# EAGLE design noise (EAGLE 7.4.0)
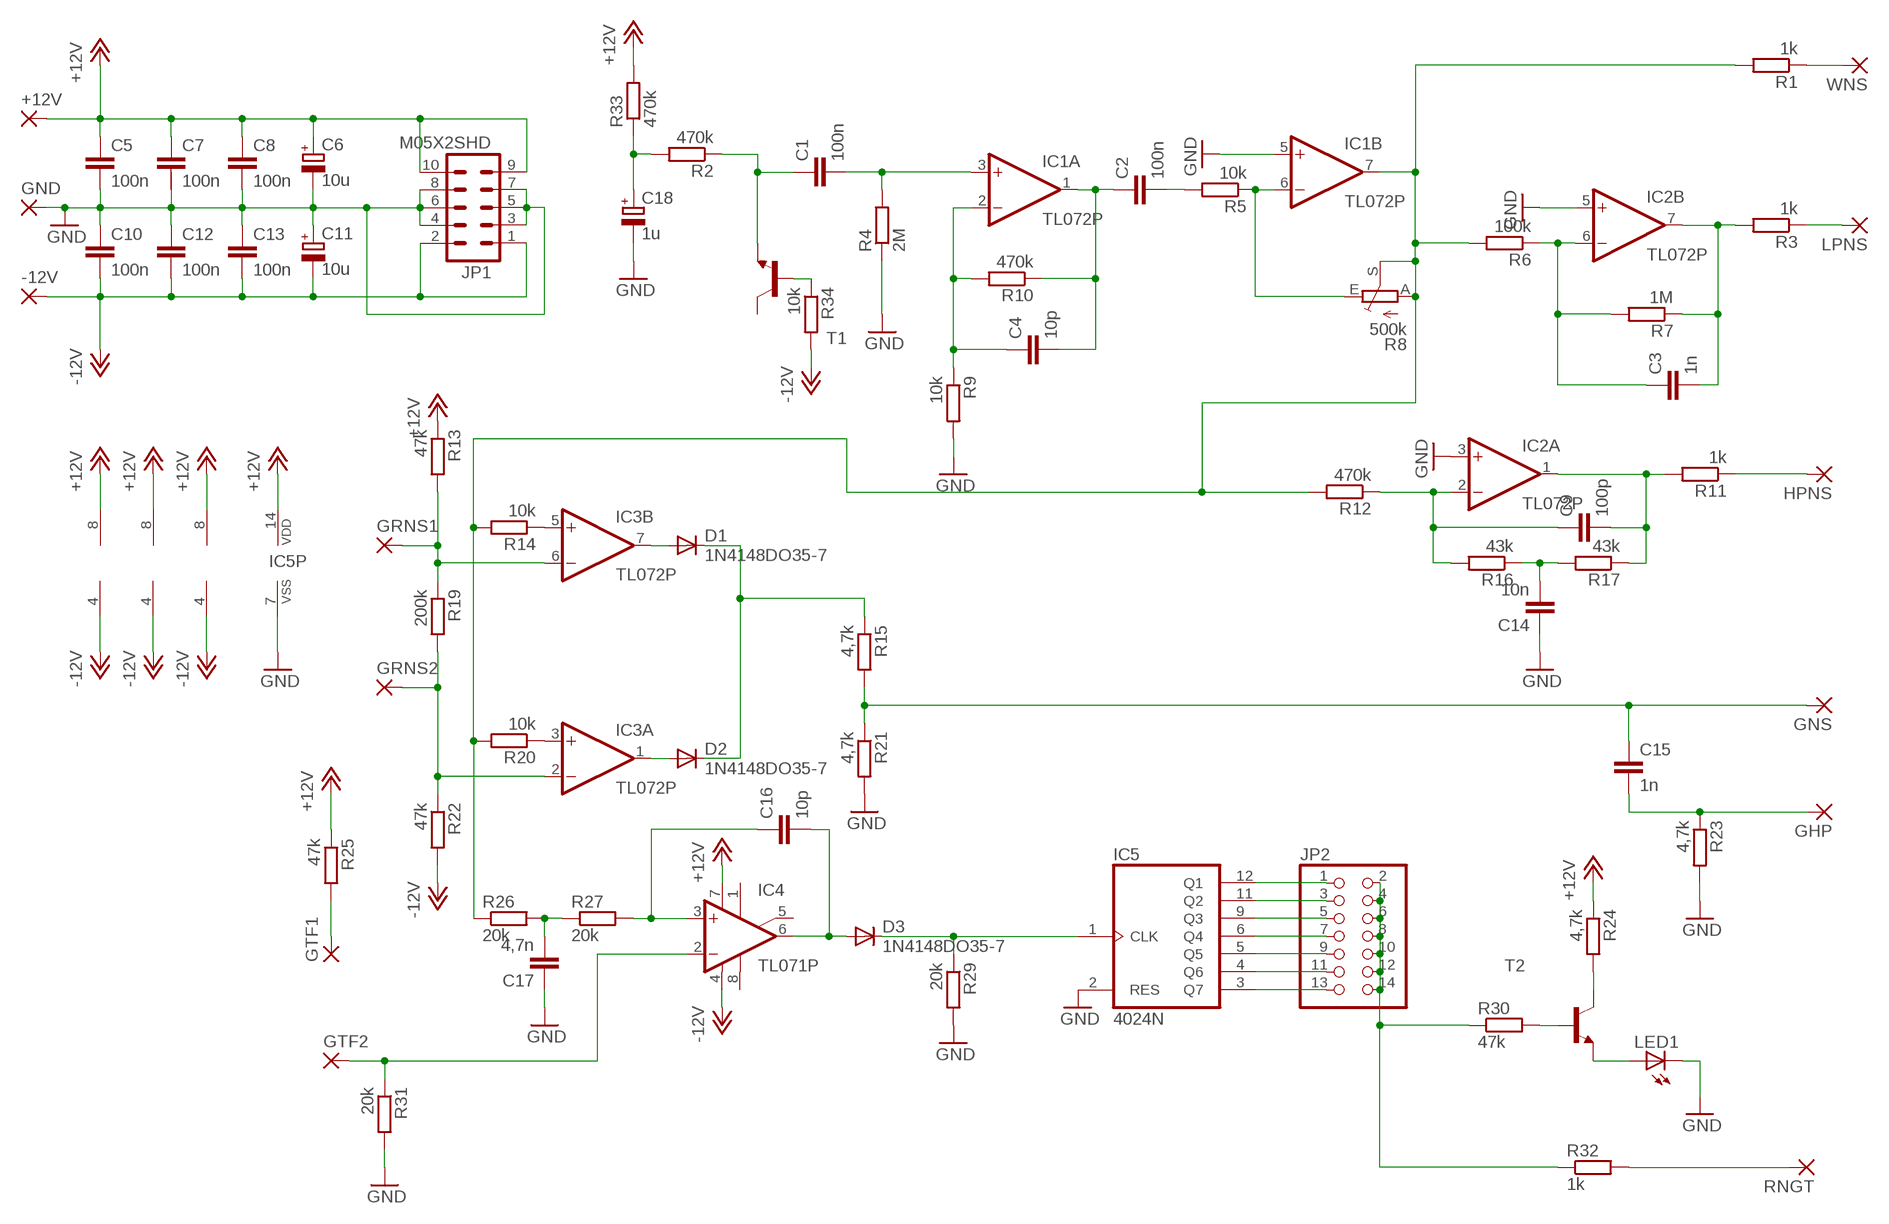
[diagram p0: schematic, sheet 1]

## Parts
+12V  2,54/1,0  [2,54/1,0]
-12V  2,54/1,0  [2,54/1,0]
C1  100n  C-EU050-035X075  [C050-035X075]
C2  100n  C-EU050-035X075  [C050-035X075]
C3  1n  C-EU050-035X075  [C050-035X075]
C4  10p  C-EU050-035X075  [C050-035X075]
C5  100n  C-EU050-035X075  [C050-035X075]
C6  10u  CPOL-EUE2.5-6  [E2,5-6]
C7  100n  C-EU050-035X075  [C050-035X075]
C8  100n  C-EU050-035X075  [C050-035X075]
C9  100p  C-EU050-035X075  [C050-035X075]
C10  100n  C-EU050-035X075  [C050-035X075]
C11  10u  CPOL-EUE2.5-6  [E2,5-6]
C12  100n  C-EU050-035X075  [C050-035X075]
C13  100n  C-EU050-035X075  [C050-035X075]
C14  10n  C-EU050-035X075  [C050-035X075]
C15  1n  C-EU050-035X075  [C050-035X075]
C16  10p  C-EU050-035X075  [C050-035X075]
C17  4,7n  C-EU050-035X075  [C050-035X075]
C18  1u  CPOL-EUE2-5  [E2-5]
D1  1N4148DO35-7  [DO35-7]
D2  1N4148DO35-7  [DO35-7]
D3  1N4148DO35-7  [DO35-7]
GHP  2,54/1,0  [2,54/1,0]
GND  2,54/1,0  [2,54/1,0]
GNS  2,54/1,0  [2,54/1,0]
GRNS1  2,54/1,0  [2,54/1,0]
GRNS2  2,54/1,0  [2,54/1,0]
GTF1  2,54/1,0  [2,54/1,0]
GTF2  2,54/1,0  [2,54/1,0]
HPNS  2,54/1,0  [2,54/1,0]
IC1  TL072P  [DIL08]
IC2  TL072P  [DIL08]
IC3  TL072P  [DIL08]
IC4  TL071P  [DIL08]
IC5  4024N  [DIL14]
JP1  M05X2SHD  [2X5-SHROUDED]
JP2  PINHD-2X7  [2X07]
LED1  LED3MM  [LED3MM]
LPNS  2,54/1,0  [2,54/1,0]
R1  1k  R-EU_0309/10  [0309/10]
R2  470k  R-EU_0309/10  [0309/10]
R3  1k  R-EU_0309/10  [0309/10]
R4  2M  R-EU_0309/10  [0309/10]
R5  10k  R-EU_0309/10  [0309/10]
R6  100k  R-EU_0309/10  [0309/10]
R7  1M  R-EU_0309/10  [0309/10]
R8  500k  TRIM_EU-RJ9W  [RJ9W]
R9  10k  R-EU_0309/10  [0309/10]
R10  470k  R-EU_0309/10  [0309/10]
R11  1k  R-EU_0309/10  [0309/10]
R12  470k  R-EU_0309/10  [0309/10]
R13  47k  R-EU_0309/10  [0309/10]
R14  10k  R-EU_0309/10  [0309/10]
R15  4,7k  R-EU_0309/10  [0309/10]
R16  43k  R-EU_0309/10  [0309/10]
R17  43k  R-EU_0309/10  [0309/10]
R19  200k  R-EU_0309/10  [0309/10]
R20  10k  R-EU_0309/10  [0309/10]
R21  4,7k  R-EU_0309/10  [0309/10]
R22  47k  R-EU_0309/10  [0309/10]
R23  4,7k  R-EU_0309/10  [0309/10]
R24  4,7k  R-EU_0309/10  [0309/10]
R25  47k  R-EU_0309/10  [0309/10]
R26  20k  R-EU_0309/10  [0309/10]
R27  20k  R-EU_0309/10  [0309/10]
R29  20k  R-EU_0309/10  [0309/10]
R30  47k  R-EU_0309/10  [0309/10]
R31  20k  R-EU_0309/10  [0309/10]
R32  1k  R-EU_0309/10  [0309/10]
R33  470k  R-EU_0309/10  [0309/10]
R34  10k  R-EU_0309/10  [0309/10]
RNGT  2,54/1,0  [2,54/1,0]
T1  2N3904-NPN-TO92-EBC  [TO92-EBC]
T2  2N3904-NPN-TO92-EBC  [TO92-EBC]
WNS  2,54/1,0  [2,54/1,0]

## Nets
+12V: +12V.1(P) C5.1 C6.+ C7.1 C8.1 IC1.8(P:V+) IC2.8(P:V+) IC3.8(P:V+) IC4.7(V+) IC5.14(VDD) JP1.9 JP1.10 R13.1 R24.1 R25.1 R33.2
-12V: -12V.1(P) C10.2 C11.- C12.2 C13.2 IC1.4(P:V-) IC2.4(P:V-) IC3.4(P:V-) IC4.4(V-) JP1.1 JP1.2 R22.2 R34.2
GND: C5.2 C6.- C7.2 C8.2 C10.1 C11.+ C12.1 C13.1 C14.1 C17.1 C18.- GND.1(P) IC1.5(B:+IN) IC2.3(A:+IN) IC2.5(B:+IN) IC5.2(RES) IC5.7(VSS) JP1.3 JP1.4 JP1.5 JP1.6 JP1.7 JP1.8 LED1.K(C) R4.1 R9.2 R21.2 R23.2 R29.2 R31.2
N$1: C18.+ R2.2 R33.1
N$2: C1.1 R2.1 T1.E
N$3: R34.1 T1.B
N$4: C1.2 IC1.3(A:+IN) R4.2
N$5: C4.1 IC1.2(A:-IN) R9.1 R10.2
N$6: C15.2 GHP.1(P) R23.1
N$7: C2.2 R5.2
N$8: IC1.6(B:-IN) R5.1 R8.E
N$9: IC1.7(B:OUT) R1.2 R6.2 R8.A R8.S R12.2 R14.2 R20.2 R26.1
N$10: R1.1 WNS.1(P)
N$11: C3.1 IC2.6(B:-IN) R6.1 R7.2
N$12: C3.2 IC2.7(B:OUT) R3.2 R7.1
N$13: LPNS.1(P) R3.1
N$14: C9.1 IC2.2(A:-IN) R12.1 R16.2
N$15: C14.2 R16.1 R17.2
N$16: C9.2 IC2.1(A:OUT) R11.2 R17.1
N$17: HPNS.1(P) R11.1
N$18: IC3.5(B:+IN) R14.1
N$19: IC3.3(A:+IN) R20.1
N$20: GRNS1.1(P) IC3.6(B:-IN) R13.2 R19.1
N$21: GRNS2.1(P) IC3.2(A:-IN) R19.2 R22.1
N$23: D1.A IC3.7(B:OUT)
N$24: D2.A IC3.1(A:OUT)
N$25: D1.C D2.C R15.1
N$26: C15.1 GNS.1(P) R15.2 R21.1
N$27: GTF2.1(P) IC4.2(-IN) R31.1
N$28: GTF1.1(P) R25.2
N$29: C16.2 D3.A IC4.6(OUT)
N$30: C16.1 IC4.3(+IN) R27.2
N$31: C17.2 R26.2 R27.1
N$32: D3.C IC5.1(CLK) R29.1
N$33: IC5.12(Q1) JP2.1
N$34: IC5.11(Q2) JP2.3
N$35: IC5.9(Q3) JP2.5
N$36: IC5.6(Q4) JP2.7
N$37: IC5.5(Q5) JP2.9
N$38: IC5.4(Q6) JP2.11
N$39: IC5.3(Q7) JP2.13
N$40: JP2.2 JP2.4 JP2.6 JP2.8 JP2.10 JP2.12 JP2.14 R30.1 R32.1
N$41: R30.2 T2.B
N$42: R24.2 T2.C
N$43: LED1.A T2.E
N$44: R32.2 RNGT.1(P)
N$45: C2.1 C4.2 IC1.1(A:OUT) R10.1
Unconnected: IC4.1(ON1) IC4.5(ON2) IC4.8(OPT) T1.C

## Library data of the parts
+12V -12V GHP GND GNS GRNS1 GRNS2 GTF1 GTF2 HPNS LPNS RNGT WNS = wirepad:2,54/1,0: THROUGH-HOLE PAD
C1-C5 C7-C10 C12-C17 = rcl:C-EU: CAPACITOR, European symbol
C6 C11 C18 = rcl:CPOL-EU: POLARIZED CAPACITOR, European symbol
D1-D3 = diode:1N4148: DIODE high speed (Philips)
IC1-IC3 = cavalier:TL072: OP AMP
IC4 = cavalier:TL071: OP AMP
IC5 = 40xx:4024: 7-stage binary/ripple COUNTER
JP1 = SparkFun:M05X2: Header 5x2 Standard 10-pin dual row 0.1" header. Commonly used with AVR-ISP. Use with Spark Fun Electronics SKU: PRT-00778
JP2 = pinhead:PINHD-2X7: PIN HEADER
LED1 = led:LED: LED OSRAM: - CHIPLED LG R971, LG N971, LY N971, LG Q971, LY Q971, LO R971, LY R971 LH N974, LH R974 LS Q976, LO Q976, LY Q976 LO Q996 - Hyper CHIPLED LW Q18S LB Q993, LB Q99A, LB R99A - SideLED LS A670, LO A670, LY A670, LG A670, LP A670 LB A673, LV A673, LT A673, LW A673 LH A674 LY A675 LS A676, LA A676, LO A676, LY A676, LW A676 LS A679, LY A679, LG A679 - Hyper Micro SIDELED® LS Y876, LA Y876, LO Y876, LY Y876 LT Y87S - SmartLED LW L88C, LW L88S LB L89C, LB L89S, LG L890 LS L89K, LO L89K, LY L89K LS L896, LA L896, LO L896, LY L896 - TOPLED LS T670, LO T670, LY T670, LG T670, LP T670 LSG T670, LSP T670, LSY T670, LOP T670, LYG T670 LG T671, LOG T671, LSG T671 LB T673, LV T673, LT T673, LW T673 LH T674 LS T676, LA T676, LO T676, LY T676, LB T676, LH T676, LSB T676, LW T676 LB T67C, LV T67C, LT T67C, LS T67K, LO T67K, LY T67K, LW E67C LS E67B, LA E67B, LO E67B, LY E67B, LB E67C, LV E67C, LT E67C LW T67C LS T679, LY T679, LG T679 LS T770, LO T770, LY T770, LG T770, LP T770 LB T773, LV T773, LT T773, LW T773 LH T774 LS E675, LA E675, LY E675, LS T675 LS T776, LA T776, LO T776, LY T776, LB T776 LHGB T686 LT T68C, LB T68C - Hyper Mini TOPLED® LB M676 - Mini TOPLED Santana® LG M470 LS M47K, LO M47K, LY M47K Source: http://www.osram.convergy.de LUXEON: - LUMILED® LXK2-PW12-R00, LXK2-PW12-S00, LXK2-PW14-U00, LXK2-PW14-V00 LXK2-PM12-R00, LXK2-PM12-S00, LXK2-PM14-U00 LXK2-PE12-Q00, LXK2-PE12-R00, LXK2-PE12-S00, LXK2-PE14-T00, LXK2-PE14-U00 LXK2-PB12-K00, LXK2-PB12-L00, LXK2-PB12-M00, LXK2-PB14-N00, LXK2-PB14-P00, LXK2-PB14-Q00 LXK2-PR12-L00, LXK2-PR12-M00, LXK2-PR14-Q00, LXK2-PR14-R00 LXK2-PD12-Q00, LXK2-PD12-R00, LXK2-PD12-S00 LXK2-PH12-R00, LXK2-PH12-S00 LXK2-PL12-P00, LXK2-PL12-Q00, LXK2-PL12-R00 Source: www.luxeon.com KINGBRIGHT: KA-3528ASYC Source: www.kingbright.com
R1-R7 R9-R17 R19-R27 R29-R34 = rcl:R-EU_: RESISTOR, European symbol
R8 = pot:TRIM_EU-: POTENTIOMETER
T1 T2 = transistor-neu-to92:*-NPN-: NPN Transistror

## Board
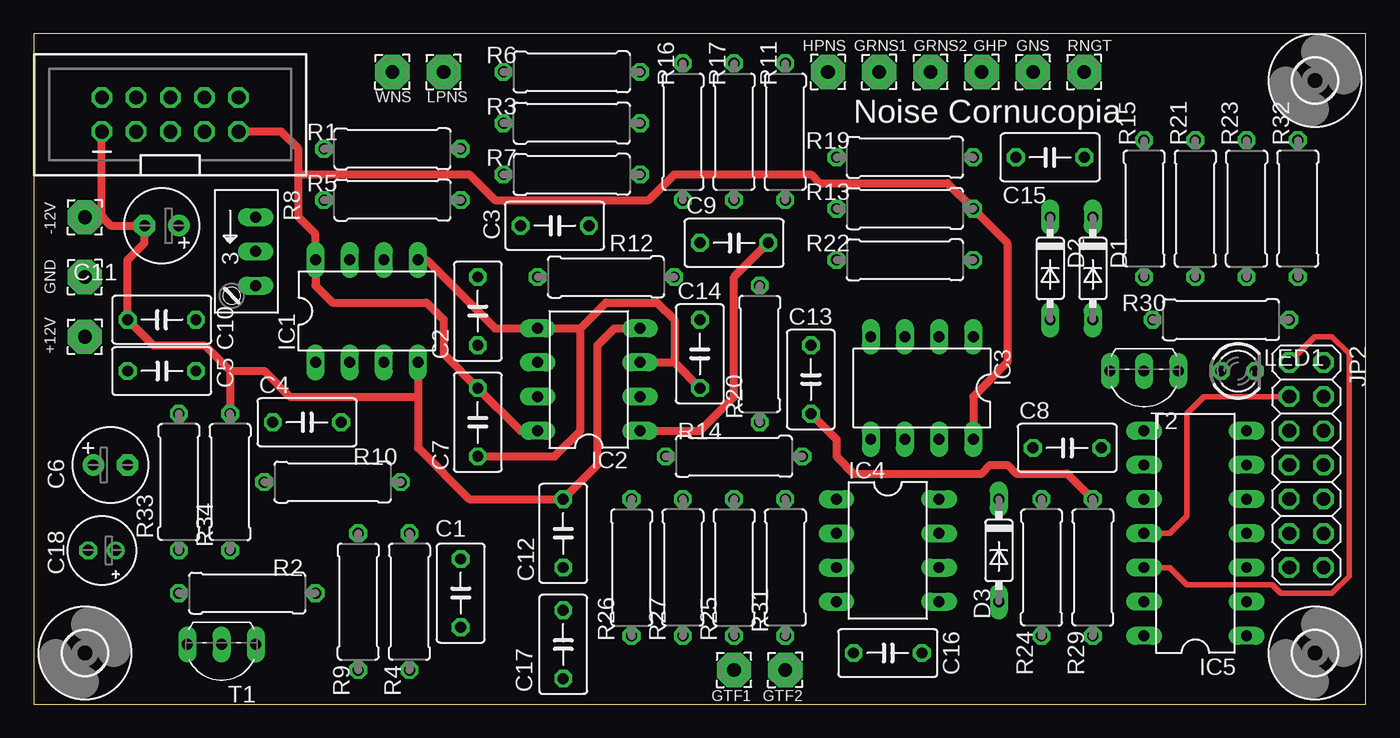
[diagram p1: board, top side]
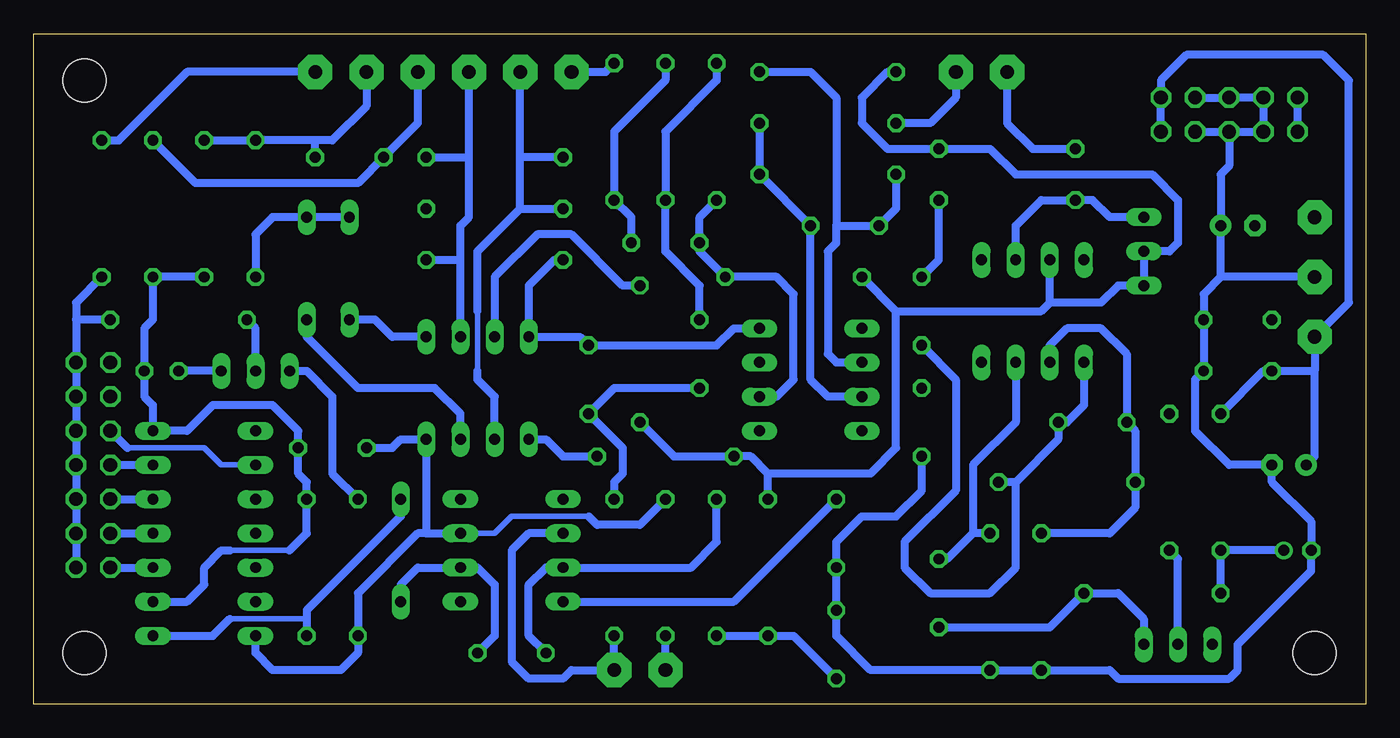
[diagram p2: board, bottom side, seen from below]

Size 99.04 x 49.84 mm. Coordinates in mm from the lower left corner, seen from the top.
Outline: 0,0 99.04,0 99.04,49.84 0,49.84 0,0
Copper layers (1*16): Top 0.035mm / dielectric 1.5mm / Bottom 0.035mm
Design rules "default": minimum track width 10mil, minimum drill 24mil, track to track 8mil, track to pad 8mil, pad to pad 8mil, via to via 8mil, smd to smd 8mil, copper to edge 40mil, drill to drill 8mil, minimum pad ring 10mil, minimum via ring 8mil, stop-mask expansion 4mil, vias tented up to drill 0mil, thermal gap 10mil

### Footprints (pad centres in the part's own frame; a part is rotated, then mirrored left to right if it is on the bottom)
2,54/1,0 = drill 1.016 pad 2.54 octagon: 1 0,0
C050-035X075 = drill 0.813 octagon: 1 -2.54,0; 2 2.54,0
E2,5-6 = drill 0.813 pad 1.6: + -1.27,0 | drill 0.813 pad 1.6 octagon: - 1.27,0
E2-5 = drill 0.813 pad 1.27: + -1.016,0 | drill 0.813 pad 1.27 octagon: - 1.016,0
DO35-7 = drill 0.813 long: A 3.81,0; C -3.81,0
DIL08 = drill 0.813 pad 1.27 long: 1 -3.81,-3.81; 2 -1.27,-3.81; 3 1.27,-3.81; 4 3.81,-3.81; 5 3.81,3.81; 6 1.27,3.81; 7 -1.27,3.81; 8 -3.81,3.81
DIL14 = drill 0.813 long: 1 -7.62,-3.81; 2 -5.08,-3.81; 3 -2.54,-3.81; 4 0,-3.81; 5 2.54,-3.81; 6 5.08,-3.81; 7 7.62,-3.81; 8 7.62,3.81; 9 5.08,3.81; 10 2.54,3.81; 11 0,3.81; 12 -2.54,3.81; 13 -5.08,3.81; 14 -7.62,3.81
2X5-SHROUDED = drill 1.016 octagon: 1 -1.27,5.08; 2 1.27,5.08; 3 -1.27,2.54; 4 1.27,2.54; 5 -1.27,0; 6 1.27,0; 7 -1.27,-2.54; 8 1.27,-2.54; 9 -1.27,-5.08; 10 1.27,-5.08
2X07 = drill 1.016 octagon: 1 -7.62,-1.27; 2 -7.62,1.27; 3 -5.08,-1.27; 4 -5.08,1.27; 5 -2.54,-1.27; 6 -2.54,1.27; 7 0,-1.27; 8 0,1.27; 9 2.54,-1.27; 10 2.54,1.27; 11 5.08,-1.27; 12 5.08,1.27; 13 7.62,-1.27; 14 7.62,1.27
LED3MM = drill 0.813 octagon: A -1.27,0; K 1.27,0
0309/10 = drill 0.813 octagon: 1 -5.08,0; 2 5.08,0
RJ9W = drill 0.813 long: A 2.54,0.635; E -2.54,0.635; S 0,0.635
TO92-EBC = drill 0.813 long: B 0,-1.27; C 2.54,-1.27; E -2.54,-1.27
3,2 = hole 3.2: 0,0

### Placement (x,y rotation side)
+12V  3.81,27.3 0 top
-12V  3.81,36.2 0 top
C1  31.75,8.26 90 top
C2  33.02,29.21 90 top
C3  38.73,35.56 0 top
C4  20.32,20.95 0 top
C5  9.53,24.77 0 top
C6  5.71,17.78 0 top
C7  33.02,20.95 270 top
C8  76.83,19.05 0 top
C9  52.07,34.29 0 top
C10  9.53,28.57 180 top
C11  9.53,35.56 180 top
C12  39.37,12.7 90 top
C13  57.78,24.13 90 top
C14  49.53,26.04 90 top
C15  75.56,40.64 180 top
C16  63.5,3.81 0 top
C17  39.37,4.45 270 top
C18  5.08,11.43 180 top
D1  78.74,32.38 270 top
D2  75.56,32.38 270 top
D3  71.75,11.43 270 top
GHP  70.48,46.99 90 top
GND  3.81,31.75 0 top
GNS  74.3,46.99 90 top
GRNS1  62.87,46.99 90 top
GRNS2  66.67,46.99 90 top
GTF1  52.07,2.54 90 top
GTF2  55.88,2.54 90 top
HPNS  59.05,46.99 180 top
IC1  24.77,29.21 0 top
IC2  41.27,24.13 90 top
IC3  66.04,23.5 180 top
IC4  63.5,11.43 270 top
IC5  86.36,12.7 90 top
JP1  10.16,43.81 90 top
JP2  94.61,17.78 270 top
LED1  89.53,24.77 0 top
LPNS  30.48,46.99 90 top
R1  26.67,41.27 0 top
R2  15.88,8.26 180 top
R3  40.01,43.18 0 top
R4  27.94,7.62 90 top
R5  26.67,37.47 0 top
R6  40.01,46.99 180 top
R7  40.01,39.37 180 top
R8  15.88,33.66 270 top
R9  24.13,7.62 270 top
R10  22.23,16.51 180 top
R11  55.88,42.55 270 top
R12  42.55,31.75 180 top
R13  64.77,36.83 180 top
R14  52.07,18.41 180 top
R15  82.55,36.83 90 top
R16  48.26,42.55 270 top
R17  52.07,42.55 270 top
R19  64.77,40.64 0 top
R20  53.98,26.04 270 top
R21  86.36,36.83 270 top
R22  64.77,33.02 180 top
R23  90.17,36.83 270 top
R24  74.93,10.16 90 top
R25  52.07,10.16 270 top
R26  44.45,10.16 270 top
R27  48.26,10.16 90 top
R29  78.74,10.16 90 top
R30  88.27,28.57 180 top
R31  55.88,10.16 90 top
R32  93.98,36.83 90 top
R33  10.79,16.51 90 top
R34  14.61,16.51 90 top
RNGT  78.11,46.99 90 top
T1  13.97,3.17 180 top
T2  82.55,23.5 180 top
U$1  [3,2]  3.81,3.81 0 top
U$2  [3,2]  95.25,3.81 0 top
U$3  [3,2]  95.25,46.35 0 top
WNS  26.67,46.99 90 top

### Tracks (layer width: path | path; a pad name or v marks a point on that pad's centre or on a via)
+12V
  Top 0.61: IC3.8 69.85,22.86 72.39,25.4 72.39,34.29 R13.1 67.94,38.73 58.42,38.73 57.78,39.37 47.62,39.37 45.72,37.47 34.29,37.47 32.38,39.37 19.68,39.37 | IC2.8 36.2,20.32 C7.1 30.48,26.04 30.48,28.57 29.21,29.84 22.23,29.84 20.95,31.11 IC1.8 20.95,34.92 19.68,36.2 19.68,39.37 | JP1.9 18.41,42.55 19.68,41.27 19.68,39.37
  Bottom 0.406: 57.78,13.97 63.5,13.97 64.77,12.7 IC4.7
  Bottom 0.61: JP1.9 JP1.10 15.24,46.35 13.34,48.26 3.17,48.26 1.27,46.35 1.27,29.84 +12V.1 3.81,24.77 | C8.1 72.39,19.05 71.75,19.68 IC3.8 69.85,12.7 | 69.85,12.7 IC4.7 | R25.1 53.98,13.34 57.15,13.34 57.78,13.97 | 69.85,12.7 70.48,12.7 74.93,8.26 R24.1 74.93,3.81 76.2,2.54 81.28,2.54 82.55,3.81 IC5.14 | 3.81,24.77 C5.1 7.62,24.77 R33.2 | C6.+ 3.81,18.41 3.81,24.77
-12V
  Top 0.61: IC1.4 28.57,22.86 | 28.57,22.86 28.57,19.05 32.38,15.24 C12.2 41.91,17.78 41.91,26.67 43.18,27.94 IC2.4 | -12V.1 5.08,36.2 | 5.08,36.2 5.21,36.2 5.21,36.07 5.71,35.56 C11.- 8.26,34.29 6.99,33.02 C10.2 8.89,26.67 12.7,26.67 14.61,24.77 | 5.08,36.2 JP1.1 | 14.61,24.77 R34.2 | 14.61,24.77 17.14,24.77 19.05,22.86 28.57,22.86
  Bottom 0.61: JP1.1 JP1.2 | R22.2 60.33,33.02 62.23,31.11 IC3.4 58.42,27.3 C13.2 48.26,26.67 46.99,27.94 IC2.4 | IC4.4 46.99,7.62 C12.2
GND
  Top 0.61: 47.62,25.4 47.62,28.57 46.35,29.84 42.55,29.84 40.64,27.94 | 47.62,25.4 C14.1 | IC2.3 47.62,25.4 | 40.64,27.94 IC2.5 34.29,27.94 29.21,33.02 IC1.5 | C13.1 59.69,19.68 59.69,18.41 60.96,17.14 70.48,17.14 71.12,17.78 72.39,17.78 73.03,17.14 76.83,17.14 R29.2 | C7.2 38.73,18.41 40.64,20.32 40.64,27.94
  Bottom 0.406: 84.45,11.43 80.01,11.43
  Bottom 0.61: R21.2 R23.2 90.17,28.57 90.81,27.94 LED1.K 90.81,22.86 90.17,22.23 IC5.7 87.63,20.32 85.72,22.23 81.28,22.23 79.38,20.32 C8.2 79.38,17.14 78.74,16.51 R29.2 78.74,12.7 80.01,11.43 | JP1.7 JP1.5 | JP1.5 JP1.3 JP1.4 JP1.6 JP1.8 | GND.1 10.79,31.75 | R31.2 55.88,16.51 55.24,17.14 55.24,19.05 C13.1 55.88,23.5 C14.1 | IC5.2 87.63,7.62 86.36,8.89 86.36,10.16 85.09,11.43 84.45,11.43 | C7.2 33.02,15.88 34.92,13.97 37.47,13.97 39.37,12.06 C12.1 C17.1 39.37,5.08 36.83,2.54 R4.1 R9.2 19.05,2.54 18.41,1.91 10.16,1.91 9.53,2.54 9.53,4.45 4.06,9.91 C18.- 4.06,13.59 6.99,16.51 C6.- 10.16,17.78 12.7,20.32 12.7,24.13 C5.2 C10.1 12.06,30.48 10.79,31.75 | 10.79,31.75 C11.+ 10.79,39.37 10.16,40.01 JP1.5
N$1
  Bottom 0.61: C18.+ R33.1 R2.2
N$2
  Bottom 0.61: C1.1 23.5,5.71 R2.1 18.41,8.26 16.51,6.35 T1.E
N$3
  Bottom 0.61: T1.B 13.97,10.79 R34.1
N$4
  Bottom 0.61: IC1.3 26.04,20.95 29.21,17.78 29.21,12.7 | 29.21,12.7 31.11,10.79 C1.2 | R4.2 29.21,12.7
N$5
  Bottom 0.61: IC1.2 23.5,26.67 22.23,27.94 19.68,27.94 17.78,26.04 C4.1 17.14,20.32 R10.2 17.14,14.61 19.05,12.7 R9.1
N$6
  Bottom 0.61: GHP.1 70.48,43.18 C15.2 74.93,38.73 87,38.73 R23.1
N$7
  Bottom 0.61: C2.2 31.75,33.02 R5.2
N$8
  Bottom 0.61: R8.E 19.05,36.2 20.32,37.47 R5.1 24.13,37.47 26.04,35.56 IC1.6
N$9
  Bottom 0.61: R6.2 35.56,46.99 37.47,45.09 37.47,43.18 35.56,41.27 R1.2 27.94,41.27 26.04,39.37 15.88,39.37 13.97,37.47 13.97,34.29 14.61,33.66 R8.S R8.A 18.41,31.11 19.68,29.84 23.5,29.84 | R20.2 51.44,18.41 R14.2 45.72,18.41 44.45,17.14 | 23.5,29.84 IC1.7 | R26.1 44.45,17.14 | 44.45,17.14 36.83,17.14 34.92,19.05 34.92,29.21 | R12.2 34.92,29.21 | 34.92,29.21 24.13,29.21 23.5,29.84
N$10
  Bottom 0.61: WNS.1 26.67,43.18 24.77,41.27 R1.1
N$11
  Bottom 0.61: R6.1 41.27,46.99 39.37,45.09 39.37,35.56 | IC2.6 39.37,25.4 40.01,26.04 40.01,33.66 39.37,34.29 39.37,35.56 | 39.37,35.56 C3.1 34.92,36.83 R7.2
N$12
  Bottom 0.61: R3.2 R7.1 C3.2 41.27,24.13 40.01,22.86 IC2.7
N$13
  Bottom 0.61: LPNS.1 30.48,45.09 32.38,43.18 R3.1
N$14
  Bottom 0.61: IC2.2 43.81,22.86 42.55,24.13 42.55,30.48 43.81,31.75 R12.1 49.53,33.66 C9.1 49.53,36.2 R16.2
N$15
  Bottom 0.61: R16.1 48.26,46.35 52.07,42.55 R17.2 52.07,33.66 49.53,31.11 C14.2
N$16
  Top 0.61: IC2.1 49.53,20.32 52.07,22.86 52.07,31.75 C9.2
  Bottom 0.61: R17.1 52.07,46.35 55.88,42.55 R11.2 54.61,36.2 C9.2
N$17
  Bottom 0.61: HPNS.1 56.52,46.99 R11.1
N$18
  Bottom 0.61: IC3.5 60.96,19.68 59.69,18.41 R14.1
N$19
  Bottom 0.61: R20.1 55.24,31.11 59.05,34.92 61.59,34.92 64.77,31.75 IC3.3
N$20
  Bottom 0.406: 66.04,24.77 66.04,29.21
  Bottom 0.61: IC3.6 64.77,22.86 66.04,24.13 66.04,24.77 | 66.04,29.21 66.04,33.66 62.87,36.83 | 62.87,36.83 62.87,40.64 | 62.87,40.64 GRNS1.1 | 62.87,36.83 R13.2 | R19.1 62.87,40.64
N$21
  Bottom 0.61: IC3.2 67.31,33.02 | 67.31,33.02 67.31,35.56 66.67,36.2 66.67,40.64 | R22.1 67.31,33.02 | R19.2 66.67,40.64 | 66.67,40.64 GRNS2.1
N$23
  Bottom 0.61: IC3.7 67.31,21.59 69.22,23.5 74.93,23.5 78.74,27.3 D1.A
N$24
  Bottom 0.61: IC3.1 72.39,27.3 73.66,28.57 D2.A
N$25
  Bottom 0.61: D2.C D1.C 81.28,36.2 82.55,34.92 R15.1
N$26
  Bottom 0.61: GNS.1 74.3,44.45 76.83,41.91 78.11,41.91 | 78.11,41.91 R15.2 R21.1 | C15.1 78.11,41.91
N$27
  Bottom 0.61: IC4.2 62.23,12.7 63.5,11.43 63.5,3.17 62.23,1.91 59.69,1.91 59.05,2.54 GTF2.1 R31.1
N$28
  Bottom 0.61: GTF1.1 R25.2
N$29
  Bottom 0.61: C16.2 64.77,5.08 64.77,8.89 66.04,10.16 IC4.6 70.48,10.16 71.75,8.89 D3.A
N$30
  Bottom 0.61: C16.1 62.23,5.08 62.23,8.89 60.96,10.16 IC4.3 50.16,10.16 48.26,12.06 R27.2
N$31
  Bottom 0.61: R27.1 R26.2 42.55,5.08 C17.2
N$32
  Bottom 0.406: 84.45,6.35 78.74,6.35
  Bottom 0.61: D3.C 71.75,13.97 78.74,6.99 78.74,6.35 R29.1 | IC5.1 85.72,5.08 84.45,6.35
N$33
  Top 0.406: JP2.1 95.25,27.3 96.52,27.3 97.79,26.04 97.79,9.53 96.52,8.26 92.71,8.26 92.08,8.89 85.72,8.89 84.45,10.16 IC5.12
N$34
  Top 0.406: IC5.11 84.45,12.7 85.72,13.97 85.72,21.59 87,22.86 JP2.3
N$35
  Bottom 0.406: 92.08,19.05 86.36,19.05 85.09,17.78 IC5.9
  Bottom 0.61: JP2.5 92.08,19.05
N$36
  Bottom 0.61: JP2.7 IC5.6
N$37
  Bottom 0.61: JP2.9 IC5.5
N$38
  Bottom 0.61: JP2.11 IC5.4
N$39
  Bottom 0.61: JP2.13 IC5.3
N$40
  Bottom 0.61: R32.1 95.89,29.84 95.89,28.57 | 95.89,28.57 JP2.2 JP2.4 JP2.6 JP2.8 JP2.10 JP2.12 JP2.14 | R30.1 95.89,28.57
N$41
  Bottom 0.61: T2.B 82.55,27.94 R30.2
N$42
  Bottom 0.61: T2.C 78.74,24.77 76.83,22.86 76.83,17.14 R24.2
N$43
  Bottom 0.61: T2.E LED1.A
N$44
  Bottom 0.61: RNGT.1 87.63,46.99 92.71,41.91 R32.2
N$45
  Bottom 0.61: IC1.1 20.95,22.23 22.23,20.95 C4.2 22.86,19.68 26.04,16.51 | C2.1 30.48,24.13 30.48,15.88 34.29,12.06 34.29,10.16 32.38,8.26 27.94,8.26 26.04,10.16 26.04,16.51 | 26.04,16.51 R10.1

### Text on the board
tPlace: Noise Cornucopia